# Altium project KillAutoSystem.PrjPcb
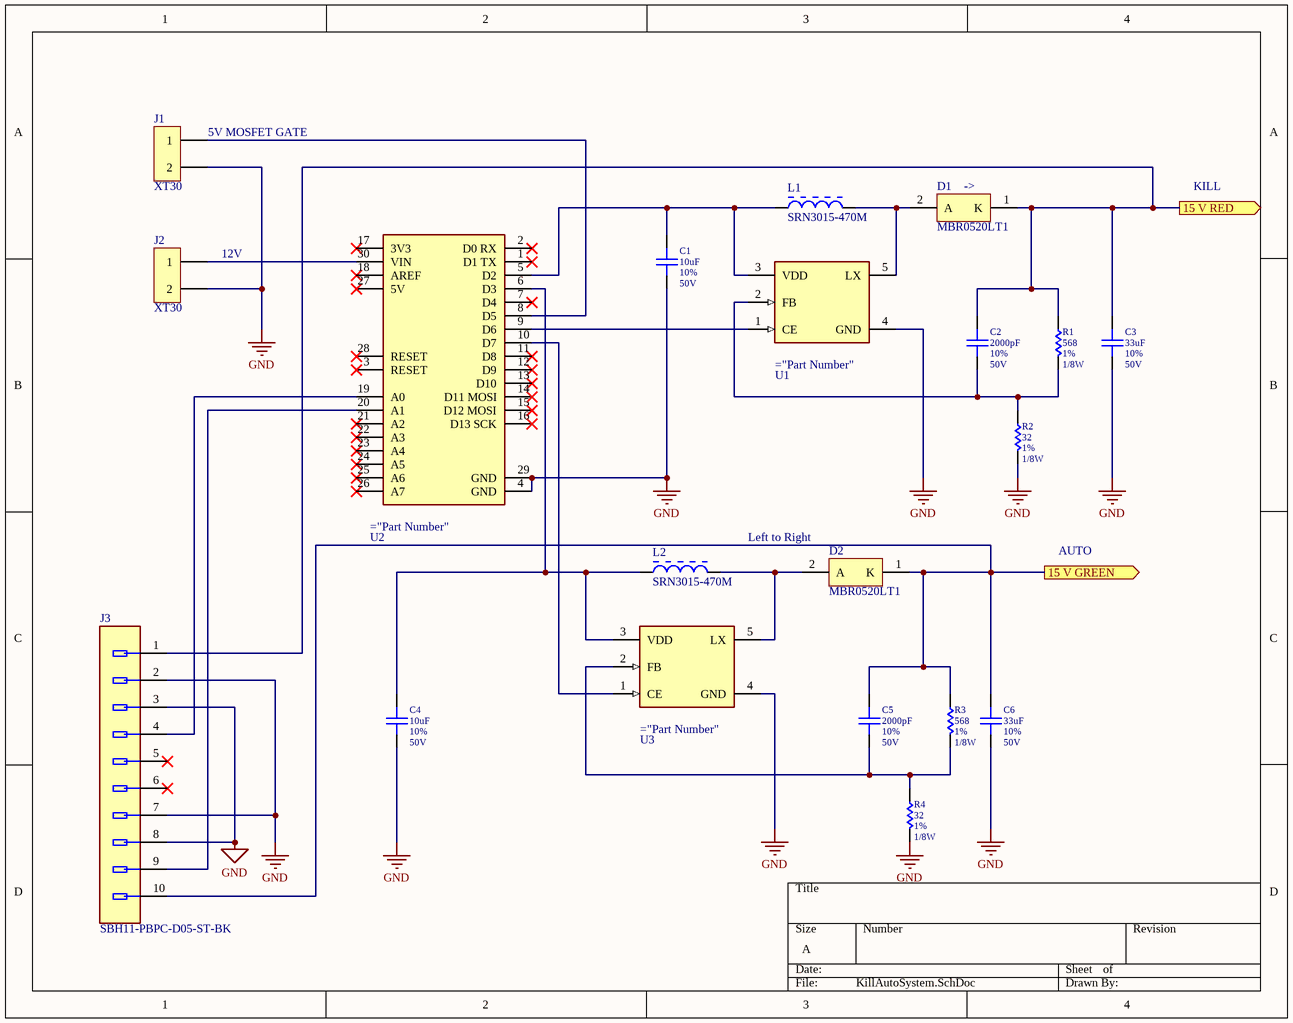
[diagram p0: KillAutoSystem.SchDoc]
1 sheet, 20 parts. Net scope: flat (ports and power ports of the same name join across sheets).
Board file: KillAutoSystemPCB.PcbDoc

## Sheet KillAutoSystem.SchDoc
size A

### Parts
C1  Capacitance: 10uF  Tolerance: 10%  Voltage: 50V  [Component 0805]  (hidden comment: Ceramic Capacitor)
C2  Capacitance: 2000pF  Tolerance: 10%  Voltage: 50V  [Component 0805]  (hidden comment: Ceramic Capacitor)
C3  Capacitance: 33uF  Tolerance: 10%  Voltage: 50V  [Component 0805]  (hidden comment: Ceramic Capacitor)
C4  Capacitance: 10uF  Tolerance: 10%  Voltage: 50V  [Component 0805]  (hidden comment: Ceramic Capacitor)
C5  Capacitance: 2000pF  Tolerance: 10%  Voltage: 50V  [Component 0805]  (hidden comment: Ceramic Capacitor)
C6  Capacitance: 33uF  Tolerance: 10%  Voltage: 50V  [Component 0805]  (hidden comment: Ceramic Capacitor)
D1  MBR0520LT1  [ONSC-SOD-123-2-425-04_V]
D2  MBR0520LT1  [ONSC-SOD-123-2-425-04_V]
J1  XT30  [Connector, XT30]
J2  XT30  [Connector, XT30]
J3  Part Number: SBH11-PBPC-D05-ST-BK  [Sullins_Headers_SBH11-PBPC-D05-ST-BK_0]  (hidden comment: Conn_Sullins_Headers_SBH11-PBPC-D05-ST-BK_eec)
L1  SRN3015-470M  [BOUR-SRN3015-2_V]
L2  SRN3015-470M  [BOUR-SRN3015-2_V]
R1  Resistance: 568  Tolerance: 1%  Power: 1/8W  [Component 0805]  (hidden comment: Resistor)
R2  Resistance: 32  Tolerance: 1%  Power: 1/8W  [Component 0805]  (hidden comment: Resistor)
R3  Resistance: 568  Tolerance: 1%  Power: 1/8W  [Component 0805]  (hidden comment: Resistor)
R4  Resistance: 32  Tolerance: 1%  Power: 1/8W  [Component 0805]  (hidden comment: Resistor)
U1  NCP1403SNT1G  [ON_Semi_483_0]  (value not drawn)
U2  Arduino_Nano_3.0  [Arduino_Arduino_Nano_3.0_0]  (value not drawn)
U3  NCP1403SNT1G  [ON_Semi_483_0]  (value not drawn)

### Ports
15 V GREEN (out), 15 V RED (out)

### Nets
GND: C1.2 C3.2 C4.2 C6.2 J1.2 J2.2 J3.2 J3.3 J3.7 J3.8 R2.2 R4.2 U1.4(GND) U2.4(GND) U2.29(GND) U3.4(GND)
NetC1_1: C1.1 L1.1 U1.3(VDD) U2.5(D2)
NetC2_1: C2.1 C3.1 D1.1(K) J3.1 R1.1 ; port 15 V RED
NetC2_2: C2.2 R1.2 R2.1 U1.2(FB)
NetC4_1: C4.1 L2.1 U2.6(D3) U3.3(VDD)
NetC5_1: C5.1 C6.1 D2.1(K) J3.10 R3.1 ; port 15 V GREEN
NetC5_2: C5.2 R3.2 R4.1 U3.2(FB)
NetD1_2: D1.2(A) L1.2 U1.5(LX)
NetD2_2: D2.2(A) L2.2 U3.5(LX)
NetJ1_1: J1.1 U2.8(D5)
NetJ2_1: J2.1 U2.30(VIN)
NetJ3_4: J3.4 U2.19(A0)
NetJ3_9: J3.9 U2.20(A1)
NetU1_1: U1.1(CE) U2.9(D6)
NetU2_10: U2.10(D7) U3.1(CE)

Not connected (* = marked no-connect by the designer): J3 5* 6*; U2 1(D1_TX)* 2(D0_RX)* 3(RESET)* 7(D4)* 11(D8)* 12(D9)* 13(D10)* 14(D11_MOSI)* 15(D12_MOSI)* 16(D13_SCK)* 17(3V3)* 18(AREF)* 21(A2)* 22(A3)* 23(A4)* 24(A5)* 25(A6)* 26(A7)* 27(5V)* 28(RESET)*

### Notes on the sheet
- (near J1) 5V MOSFET GATE
- (near D1) ->
- KILL
- (near J2) 12V
- (near D2) Left to Right
- AUTO

### Library data of the parts
C1-C6 = Capacitor, Ceramic: *
D1 D2 = MBR0520LT1: Schottky Power Rectifier, 2-Pin SOD-123, Tape and Reel; Manufacturer: On Semiconductor; IFSM Max (A): 5.5; Configuration: Single; ComponentLink1Description: Manufacturer URL; ComponentLink2Description: Datasheet; DatasheetVersion: Rev. 6; PackageReference: SOD-123-2-425-04; ComponentLink3URL: http://www.onsemi.com/pub_link/Collateral/425-04.PDF; ComponentLink3Description: Package Specification; ComponentLink1URL: http://www.onsemi.com/; ComponentLink2URL: http://www.onsemi.cn/pub_link/Collateral/MBR0520LT1-D.PDF; Packing: Tape and Reel; PackageVersion: Rev. G, 10/2009; PartNumber: MBR0520LT1; PackageDescription: 2-Pin SOD, Body 1.6 x 2.69 mm; Mounting Technology: Surface Mount; RoHS: FALSE
J1 J2 = Connector, XT30
J3 = Conn_Sullins_Headers_SBH11-PBPC-D05-ST-BK_eec: CONN 10 Positions Header Connector 0.100" (2.54mm) Through Hole Gold; Manufacturer: Sullins Headers; Current Rating: 3 Amps; Insulation Resistance: 5000 Megohms Min.; Dielectric Withstanding: 1000 VAC; Symbol 0 0: Standard; Num Pins: 10; helpURL: https://upverter.com/upn/revision/2cdea3ecd1cfac0f/; ComponentLink2Description: Datasheet; Temperature: -40°C to +105°C; Package: HDR10; Supplier 2: Mouser; Supplier 1: Digi-Key; ComponentLink1URL: https://upverter.com/upn/revision/2cdea3ecd1cfac0f/; Supplier Part Number 1: S9169-ND; ComponentLink1Description: Upverter; ComponentLink2URL: https://drawings-pdf.s3.amazonaws.com/11091.pdf; RoHS: TRUE; Temperature Range High: +105°C; Temperature Range Low: -40°C; Digikey Part Number: S9169-ND; Type: integrated circuit; Lead Free: yes; Digikey Description: CONN 10 Positions Header Connector 0.100" (2.54mm) Through Hole Gold
L1 L2 = SRN3015-470M: Semi-shielded Power Inductor, 47 uH, +/- 20%, 0.4 A, -40 to 125 degC, 3 x 3 x 1.5 mm SMD, RoHS and Halogen Free, Tape and Reel; Manufacturer: Bourns; Rated current: 0.4 A; DCR Max: 1.406 Ohm; SRF Min: 18 MHz; Inductance: 47 uH; Isat: 0.38 A; Resistance to Solder Heat: +260 degC for 10 sec.; Inductance tolerance: +/- 20%; Operating Temperature: -40 to 125 degC; PartNumber: SRN3015-470M; ComponentLink1Description: Manufacturer URL; ComponentLink2Description: Datasheet; DatasheetVersion: Aug-11; ComponentLink3URL: http://www.bourns.com/data/global/pdfs/SRN3015.pdf; ComponentLink1URL: http://www.bourns.com/; Packing: Tape and Reel; ComponentLink2URL: http://www.bourns.com/data/global/pdfs/SRN3015.pdf; PackageReference: SRN3015; ComponentLink3Description: Package Specification; RoHS: TRUE; Mounting Technology: Surface Mount; PackageDescription: 2-Pin SMD, Body 3 x 3 mm, Height 1.5 mm
R1-R4 = Resistor: Thick Film Resistors - SMD 1/16watt 1%
U1 U3 = NCP1403SNT1G: Boost Converter